# EAGLE schematic EasyBMS (EAGLE 9.6.2)
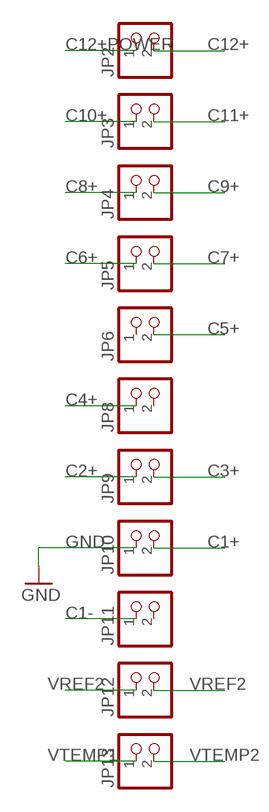
[diagram p0: schematic, sheet 1, part 1 of 3]
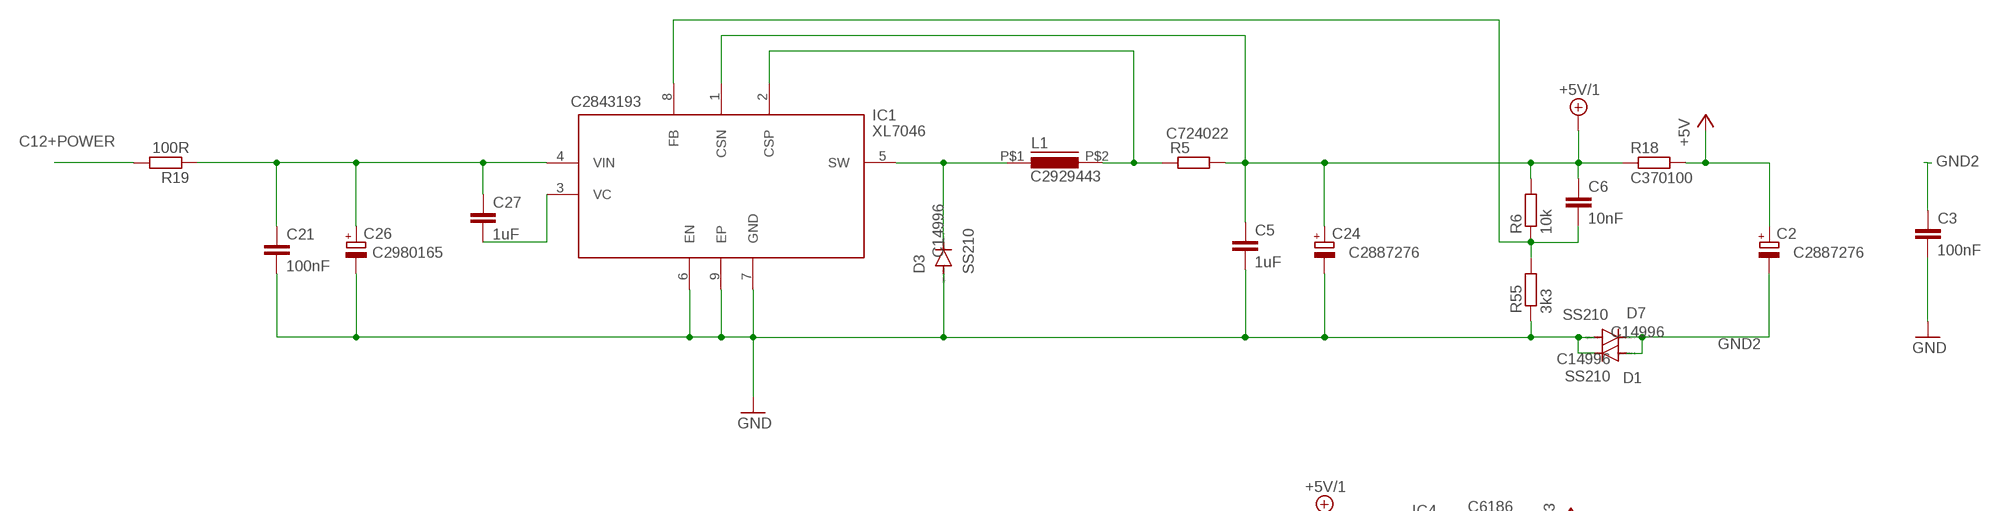
[diagram p1: schematic, sheet 1, part 2 of 3]
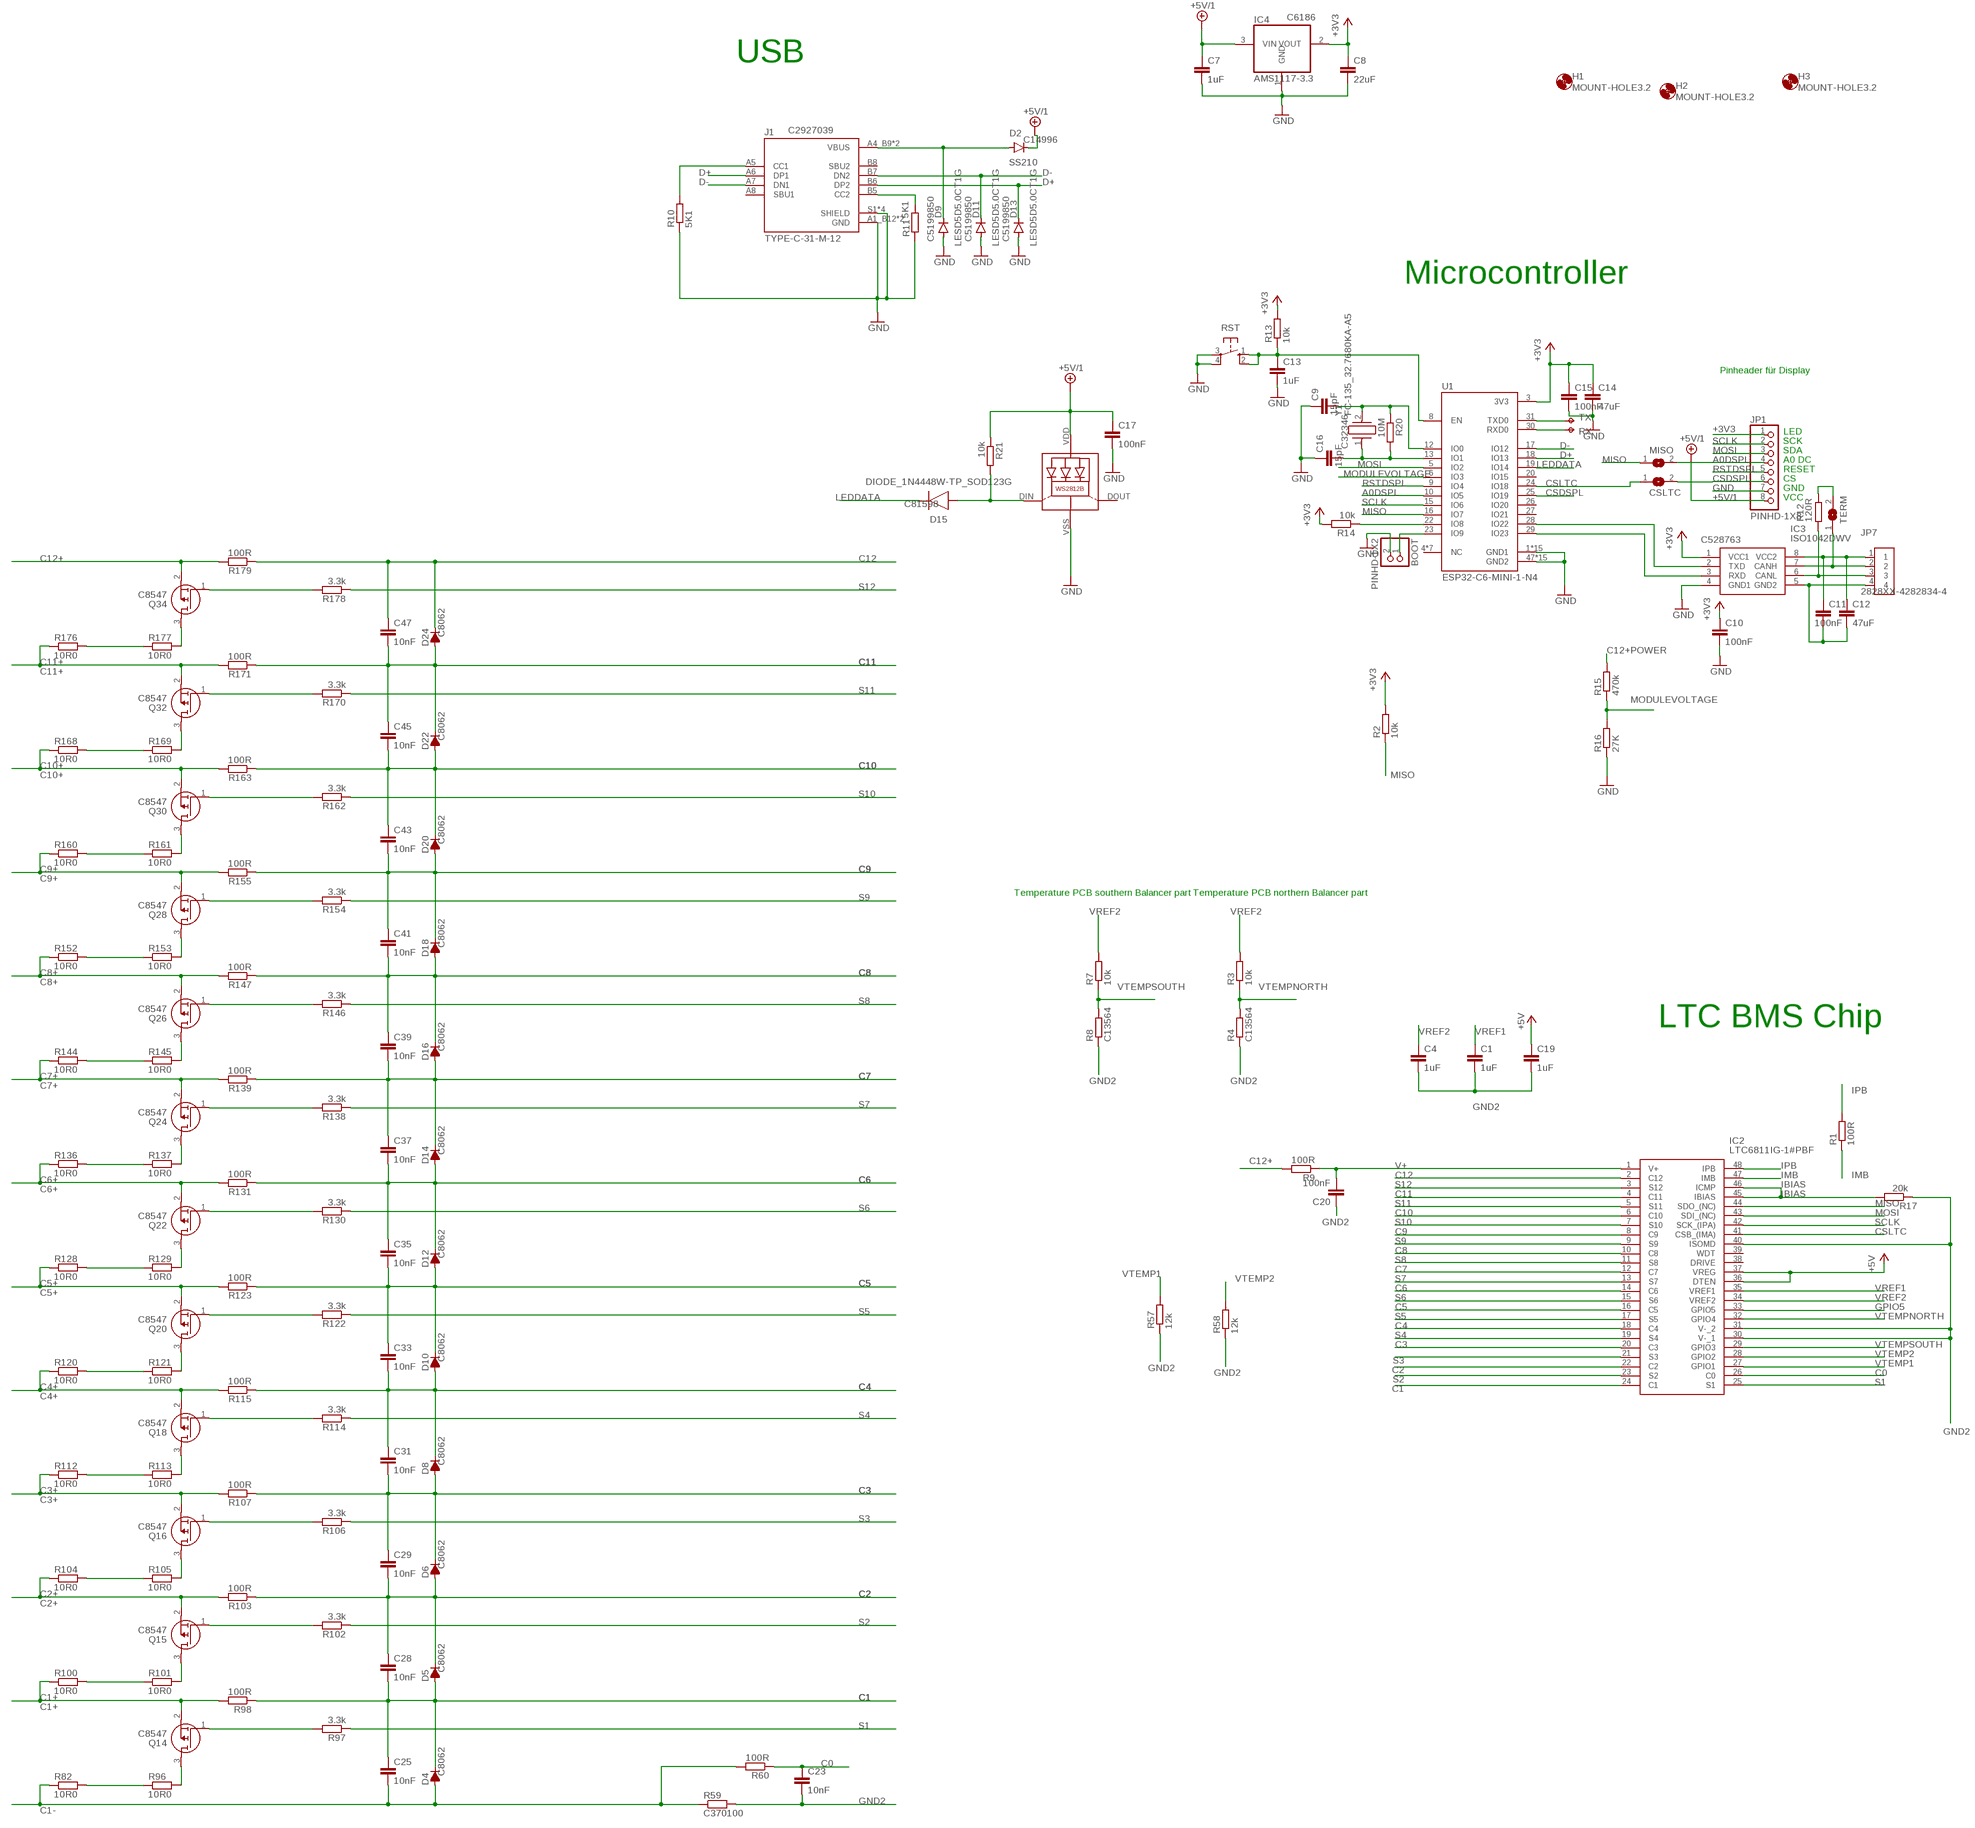
[diagram p2: schematic, sheet 1, part 3 of 3]

## Parts
BOOT  PINHD-1X2  [1X02]
C1  1uF  C-EUC0402  [C0402]
C2  CPOL-EU153CLV-0605  [153CLV-0605]
C3  100nF  C-EUC0402  [C0402]
C4  1uF  C-EUC0402  [C0402]
C5  1uF  C-EUC0402  [C0402]
C6  10nF  C-EUC0402  [C0402]
C7  1uF  C-EUC0402  [C0402]
C8  22uF  C-EUC0603  [C0603]
C9  15pF  C-EUC0402  [C0402]
C10  100nF  C-EUC0402  [C0402]
C11  100nF  C-EUC0402  [C0402]
C12  47uF  C-EUC1206  [C1206]
C13  1uF  C-EUC0402  [C0402]
C14  47uF  C-EUC0805  [C0805]
C15  100nF  C-EUC0402  [C0402]
C16  15pF  C-EUC0402  [C0402]
C17  100nF  C-EUC0402  [C0402]
C19  1uF  C-EUC0402  [C0402]
C20  100nF  C-EUC0805  [C0805]
C21  100nF  C-EUC0805  [C0805]
C23  10nF  C-EUC0402  [C0402]
C24  CPOL-EU153CLV-0605  [153CLV-0605]
C25  10nF  C-EUC0402  [C0402]
C26  CPOL-EU153CLV-0605  [153CLV-0605]
C27  1uF  C-EUC0603  [C0603]
C28  10nF  C-EUC0402  [C0402]
C29  10nF  C-EUC0402  [C0402]
C31  10nF  C-EUC0402  [C0402]
C33  10nF  C-EUC0402  [C0402]
C35  10nF  C-EUC0402  [C0402]
C37  10nF  C-EUC0402  [C0402]
C39  10nF  C-EUC0402  [C0402]
C41  10nF  C-EUC0402  [C0402]
C43  10nF  C-EUC0402  [C0402]
C45  10nF  C-EUC0402  [C0402]
C47  10nF  C-EUC0402  [C0402]
CSLTC  SJ  [SJ]
D1  SS210  DIODE-DO214AC  [DO214AC]
D2  SS210  DIODE-DO214AC  [DO214AC]
D3  SS210  DIODE-DO214AC  [DO214AC]
D4  D-FILL-MLL-34  [MELF-MLL34]
D5  D-FILL-MLL-34  [MELF-MLL34]
D6  D-FILL-MLL-34  [MELF-MLL34]
D7  SS210  DIODE-DO214AC  [DO214AC]
D8  D-FILL-MLL-34  [MELF-MLL34]
D9  LESD5D5.0CT1G  DIODE-SOD523  [SOD523]
D10  D-FILL-MLL-34  [MELF-MLL34]
D11  LESD5D5.0CT1G  DIODE-SOD523  [SOD523]
D12  D-FILL-MLL-34  [MELF-MLL34]
D13  LESD5D5.0CT1G  DIODE-SOD523  [SOD523]
D14  D-FILL-MLL-34  [MELF-MLL34]
D15  DIODE_1N4448W-TP_SOD123G  [SOD3715X135]
D16  D-FILL-MLL-34  [MELF-MLL34]
D18  D-FILL-MLL-34  [MELF-MLL34]
D20  D-FILL-MLL-34  [MELF-MLL34]
D22  D-FILL-MLL-34  [MELF-MLL34]
D24  D-FILL-MLL-34  [MELF-MLL34]
H1  MOUNT-HOLE3.2  [3,2]
H2  MOUNT-HOLE3.2  [3,2]
H3  MOUNT-HOLE3.2  [3,2]
IC1  XL7046  [SOIC127P600X170-9N]
IC2  LTC6811IG-1#PBF  [SOP50P780X200-48N]
IC3  ISO1042DWV  [SOIC127P1150X280-8N]
IC4  AMS1117-3.3  REG1117  [SOT223]
J1  TYPE-C-31-M-12  [HRO_TYPE-C-31-M-12]
JP1  PINHD-1X8  [1X08]
JP2  PINHD-1X2  [1X02]
JP3  PINHD-1X2  [1X02]
JP4  PINHD-1X2  [1X02]
JP5  PINHD-1X2  [1X02]
JP6  PINHD-1X2  [1X02]
JP7  2828XX-4282834-4  [TERMBLK_254-4N]
JP8  PINHD-1X2  [1X02]
JP9  PINHD-1X2  [1X02]
JP10  PINHD-1X2  [1X02]
JP11  PINHD-1X2  [1X02]
JP12  PINHD-1X2  [1X02]
JP13  PINHD-1X2  [1X02]
L1  C2929443  CY75-100UH  [CY75-100UH]
LED2  XL-1615RGBC-WS2812B  [XL-1615RGBC-WS2812B]
MISO  SJ  [SJ]
Q14  C8547  BSS308PEH6327XTSA1  [PG-SOT-23]
Q15  C8547  BSS308PEH6327XTSA1  [PG-SOT-23]
Q16  C8547  BSS308PEH6327XTSA1  [PG-SOT-23]
Q18  C8547  BSS308PEH6327XTSA1  [PG-SOT-23]
Q20  C8547  BSS308PEH6327XTSA1  [PG-SOT-23]
Q22  C8547  BSS308PEH6327XTSA1  [PG-SOT-23]
Q24  C8547  BSS308PEH6327XTSA1  [PG-SOT-23]
Q26  C8547  BSS308PEH6327XTSA1  [PG-SOT-23]
Q28  C8547  BSS308PEH6327XTSA1  [PG-SOT-23]
Q30  C8547  BSS308PEH6327XTSA1  [PG-SOT-23]
Q32  C8547  BSS308PEH6327XTSA1  [PG-SOT-23]
Q34  C8547  BSS308PEH6327XTSA1  [PG-SOT-23]
R1  100R  R-EU_R0603  [R0603]
R2  10k  R-EU_R0402  [R0402]
R3  10k  R-EU_R0603  [R0603]
R4  C13564  R-EU_R0603  [R0603]
R5  R-EU_R0402  [R0402]
R6  10k  R-EU_R0402  [R0402]
R7  10k  R-EU_R0603  [R0603]
R8  C13564  R-EU_R0603  [R0603]
R9  100R  R-EU_R0402  [R0402]
R10  5K1  R-EU_R0402  [R0402]
R11  5K1  R-EU_R0402  [R0402]
R12  120R  R-EU_R0402  [R0402]
R13  10k  R-EU_R0402  [R0402]
R14  10k  R-EU_R0402  [R0402]
R15  470k  R-EU_R0603  [R0603]
R16  27K  R-EU_R0603  [R0603]
R17  20k  R-EU_R0603  [R0603]
R18  C370100  R-EU_R1206  [R1206]
R19  100R  R-EU_R1206  [R1206]
R20  10M  R-EU_R0402  [R0402]
R21  10k  R-EU_R0402  [R0402]
R55  3k3  R-EU_R0402  [R0402]
R57  12k  R-EU_R0402  [R0402]
R58  12k  R-EU_R0402  [R0402]
R59  C370100  R-EU_R1206  [R1206]
R60  100R  R-EU_R0402  [R0402]
R82  10R0  R-EU_R1206  [R1206]
R96  10R0  R-EU_R1206  [R1206]
R97  3.3k  R-EU_R0402  [R0402]
R98  100R  R-EU_R0402  [R0402]
R100  10R0  R-EU_R1206  [R1206]
R101  10R0  R-EU_R1206  [R1206]
R102  3.3k  R-EU_R0402  [R0402]
R103  100R  R-EU_R0402  [R0402]
R104  10R0  R-EU_R1206  [R1206]
R105  10R0  R-EU_R1206  [R1206]
R106  3.3k  R-EU_R0402  [R0402]
R107  100R  R-EU_R0402  [R0402]
R112  10R0  R-EU_R1206  [R1206]
R113  10R0  R-EU_R1206  [R1206]
R114  3.3k  R-EU_R0402  [R0402]
R115  100R  R-EU_R0402  [R0402]
R120  10R0  R-EU_R1206  [R1206]
R121  10R0  R-EU_R1206  [R1206]
R122  3.3k  R-EU_R0402  [R0402]
R123  100R  R-EU_R0402  [R0402]
R128  10R0  R-EU_R1206  [R1206]
R129  10R0  R-EU_R1206  [R1206]
R130  3.3k  R-EU_R0402  [R0402]
R131  100R  R-EU_R0402  [R0402]
R136  10R0  R-EU_R1206  [R1206]
R137  10R0  R-EU_R1206  [R1206]
R138  3.3k  R-EU_R0402  [R0402]
R139  100R  R-EU_R0402  [R0402]
R144  10R0  R-EU_R1206  [R1206]
R145  10R0  R-EU_R1206  [R1206]
R146  3.3k  R-EU_R0402  [R0402]
R147  100R  R-EU_R0402  [R0402]
R152  10R0  R-EU_R1206  [R1206]
R153  10R0  R-EU_R1206  [R1206]
R154  3.3k  R-EU_R0402  [R0402]
R155  100R  R-EU_R0402  [R0402]
R160  10R0  R-EU_R1206  [R1206]
R161  10R0  R-EU_R1206  [R1206]
R162  3.3k  R-EU_R0402  [R0402]
R163  100R  R-EU_R0402  [R0402]
R168  10R0  R-EU_R1206  [R1206]
R169  10R0  R-EU_R1206  [R1206]
R170  3.3k  R-EU_R0402  [R0402]
R171  100R  R-EU_R0402  [R0402]
R176  10R0  R-EU_R1206  [R1206]
R177  10R0  R-EU_R1206  [R1206]
R178  3.3k  R-EU_R0402  [R0402]
R179  100R  R-EU_R0402  [R0402]
RST  10-XX  [B3F-10XX]
RX  TPB2,54  [B2,54]
TERM  SJ  [SJ]
TX  TPB2,54  [B2,54]
U1  ESP32-C6-MINI-1-N4  [XCVR_ESP32-C6-MINI-1-N4]
Y1  FC-135_32.7680KA-A5  [FC135327680KAA5]

## Nets
+3V3: C8.1 C10.1 C14.1 C15.1 IC3.1(VCC1) IC4.2(VOUT) JP1.1 R2.2 R13.2 R14.2 U1.3(3V3)
+5V: C2.+ C19.1 IC2.36(DTEN) IC2.37(VREG) R18.2
+5V/1: C5.1 C6.1 C7.1 C17.1 C24.+ D2.C IC1.1(CSN) IC4.3(VIN) JP1.8 LED2.VDD R5.2 R6.2 R18.1 R21.1
A0DSPL: JP1.4 MISO.2 U1.10(IO5)
C0: C23.1 IC2.26(C0) R60.1
C1: C25.1 C28.2 D4.1(C) D5.2(A) IC2.24(C1) R98.1
C1+: JP10.2 Q14.2(S) R98.2 R100.1
C1-: C25.2 D4.2(A) JP11.1 R59.1 R60.2 R82.1
C2: C28.1 C29.2 D5.1(C) D6.2(A) IC2.22(C2) R103.1
C2+: JP9.1 Q15.2(S) R103.2 R104.1
C3: C29.1 C31.2 D6.1(C) D8.2(A) IC2.20(C3) R107.1
C3+: JP9.2 Q16.2(S) R107.2 R112.1
C4: C31.1 C33.2 D8.1(C) D10.2(A) IC2.18(C4) R115.1
C4+: JP8.1 Q18.2(S) R115.2 R120.1
C5: C33.1 C35.2 D10.1(C) D12.2(A) IC2.16(C5) R123.1
C5+: JP6.2 Q20.2(S) R123.2 R128.1
C6: C35.1 C37.2 D12.1(C) D14.2(A) IC2.14(C6) R131.1
C6+: JP5.1 Q22.2(S) R131.2 R136.1
C7: C37.1 C39.2 D14.1(C) D16.2(A) IC2.12(C7) R139.1
C7+: JP5.2 Q24.2(S) R139.2 R144.1
C8: C39.1 C41.2 D16.1(C) D18.2(A) IC2.10(C8) R147.1
C8+: JP4.1 Q26.2(S) R147.2 R152.1
C9: C41.1 C43.2 D18.1(C) D20.2(A) IC2.8(C9) R155.1
C9+: JP4.2 Q28.2(S) R155.2 R160.1
C10: C43.1 C45.2 D20.1(C) D22.2(A) IC2.6(C10) R163.1
C10+: JP3.1 Q30.2(S) R163.2 R168.1
C11: C45.1 C47.2 D22.1(C) D24.2(A) IC2.4(C11) R171.1
C11+: JP3.2 Q32.2(S) R171.2 R176.1
C12: C47.1 D24.1(C) IC2.2(C12) R179.1
C12+: JP2.2 Q34.2(S) R9.2 R179.2
C12+POWER: JP2.1 R15.2 R19.2
CSDSPL: CSLTC.2 JP1.6 U1.25(IO19)
CSLTC: CSLTC.1 IC2.41(CSB_(IMA)) U1.24(IO18)
D+: D13.C J1.A6(DP1) J1.B6(DP2) U1.18(IO13)
D-: D11.C J1.A7(DN1) J1.B7(DN2) U1.17(IO12)
GND: BOOT.2 C3.2 C5.2 C7.2 C8.2 C9.1 C10.2 C13.2 C14.2 C15.2 C16.1 C17.2 C21.2 C24.- C26.- D1.C D3.A D7.A D9.A D11.A D13.A IC1.6(EN) IC1.7(GND) IC1.9(EP) IC3.4(GND1) IC4.1(GND) J1.A1_B12(GND) J1.B1_A12(GND) J1.S1(SHIELD) J1.S2(SHIELD) J1.S3(SHIELD) J1.S4(SHIELD) JP1.7 JP10.1 LED2.VSS(GND) R10.1 R11.1 R16.1 R55.1 RST.3(P) RST.4(P1) U1.1(GND1) U1.2(GND1) U1.11(GND1) U1.14(GND1) U1.36(GND1) U1.37(GND1) U1.38(GND1) U1.39(GND1) U1.40(GND1) U1.41(GND1) U1.42(GND1) U1.43(GND1) U1.44(GND1) U1.45(GND1) U1.46(GND1) U1.47(GND2) U1.48(GND2) U1.49_1(GND2) U1.49_2(GND2) U1.49_3(GND2) U1.49_4(GND2) U1.49_5(GND2) U1.49_6(GND2) U1.49_7(GND2) U1.49_8(GND2) U1.49_9(GND2) U1.50(GND2) U1.51(GND2) U1.52(GND2) U1.53(GND2)
GND2: C1.2 C2.- C3.1 C4.2 C19.2 C20.1 C23.2 D1.A D7.C IC2.30(V-_1) IC2.31(V-_2) IC2.40(ISOMD) R4.1 R8.1 R17.1 R57.1 R58.1 R59.2
GPIO5: IC2.33(GPIO5)
IBIAS: IC2.45(IBIAS) IC2.46(ICMP) R17.2
IMB: IC2.47(IMB) R1.1
IPB: IC2.48(IPB) R1.2
LEDDATA: D15.1(C) U1.19(IO14)
MISO: IC2.44(SDO_(NC)) MISO.1 R2.1 U1.16(IO7)
MODULEVOLTAGE: R15.1 R16.2 U1.6(IO3)
MOSI: IC2.43(SDI_(NC)) JP1.3 U1.5(IO2)
N$1: IC3.2(TXD) U1.28(IO22)
N$2: TX.TP U1.31(TXD0)
N$4: D2.A D9.C J1.A4_B9(VBUS) J1.B4_A9(VBUS)
N$6: C27.2 IC1.3(VC)
N$7: D3.C IC1.5(SW) L1.P$1
N$8: J1.A5(CC1) R10.2
N$9: J1.B5(CC2) R11.2
N$10: RX.TP U1.30(RXD0)
N$11: IC3.3(RXD) U1.29(IO23)
N$12: C11.1 C12.1 IC3.8(VCC2) JP7.1
N$13: IC3.7(CANH) JP7.2 TERM.1
N$14: IC3.6(CANL) JP7.3 R12.1
N$15: IC1.2(CSP) L1.P$2 R5.1
N$16: C11.2 C12.2 IC3.5(GND2) JP7.4
N$17: C13.1 R13.1 RST.1(S) RST.2(S1) U1.8(EN)
N$18: R82.2 R96.1
N$19: R12.2 TERM.2
N$20: R14.1 U1.22(IO8)
N$21: BOOT.1 U1.23(IO9)
N$22: C9.2 R20.1 U1.12(IO0) Y1.2
N$23: C16.2 R20.2 U1.13(IO1) Y1.1
N$24: D15.2(A) LED2.DIN(DI) R21.2
N$25: C6.2 IC1.8(FB) R6.1 R55.2
N$73: C21.1 C26.+ C27.1 IC1.4(VIN) R19.1
N$75: Q14.3(D) R96.2
N$76: Q14.1(G) R97.2
N$77: R100.2 R101.1
N$78: Q15.3(D) R101.2
N$79: Q15.1(G) R102.2
N$81: R104.2 R105.1
N$82: Q16.3(D) R105.2
N$83: Q16.1(G) R106.2
N$87: R112.2 R113.1
N$88: Q18.3(D) R113.2
N$89: Q18.1(G) R114.2
N$93: R120.2 R121.1
N$94: Q20.3(D) R121.2
N$95: Q20.1(G) R122.2
N$99: R128.2 R129.1
N$100: Q22.3(D) R129.2
N$101: Q22.1(G) R130.2
N$105: R136.2 R137.1
N$106: Q24.3(D) R137.2
N$107: Q24.1(G) R138.2
N$111: R144.2 R145.1
N$112: Q26.3(D) R145.2
N$113: Q26.1(G) R146.2
N$117: R152.2 R153.1
N$118: Q28.3(D) R153.2
N$119: Q28.1(G) R154.2
N$123: R160.2 R161.1
N$125: Q30.3(D) R161.2
N$126: Q30.1(G) R162.2
N$130: R168.2 R169.1
N$131: Q32.3(D) R169.2
N$132: Q32.1(G) R170.2
N$136: R176.2 R177.1
N$137: Q34.3(D) R177.2
N$138: Q34.1(G) R178.2
RSTDSPL: JP1.5 U1.9(IO4)
S1: IC2.25(S1) R97.1
S2: IC2.23(S2) R102.1
S3: IC2.21(S3) R106.1
S4: IC2.19(S4) R114.1
S5: IC2.17(S5) R122.1
S6: IC2.15(S6) R130.1
S7: IC2.13(S7) R138.1
S8: IC2.11(S8) R146.1
S9: IC2.9(S9) R154.1
S10: IC2.7(S10) R162.1
S11: IC2.5(S11) R170.1
S12: IC2.3(S12) R178.1
SCLK: IC2.42(SCK_(IPA)) JP1.2 U1.15(IO6)
V+: C20.2 IC2.1(V+) R9.1
VREF1: C1.1 IC2.35(VREF1)
VREF2: C4.1 IC2.34(VREF2) JP12.1 JP12.2 R3.2 R7.2
VTEMP1: IC2.27(GPIO1) JP13.1 R57.2
VTEMP2: IC2.28(GPIO2) JP13.2 R58.2
VTEMPNORTH: IC2.32(GPIO4) R3.1 R4.2
VTEMPSOUTH: IC2.29(GPIO3) R7.1 R8.2
Unconnected: IC2.38(DRIVE) IC2.39(WDT) J1.A8(SBU1) J1.B8(SBU2) JP6.1 JP8.2 JP11.2 LED2.DOUT(DO) U1.4(NC) U1.7(NC) U1.20(IO15) U1.21(NC) U1.26(IO20) U1.27(IO21) U1.32(NC) U1.33(NC) U1.34(NC) U1.35(NC)

## Notes on the sheet
- USB
- Microcontroller
- Pinheader für Display
- LED
- SCK
- SDA
- A0 DC
- RESET
- CS
- GND
- VCC
- Temperature PCB southern Balancer part | Temperature PCB northern Balancer part
- LTC BMS Chip

## Library data of the parts
BOOT = Connector:PINHD-1X2: PIN HEADER; CATEGORY: Headers; DESCRIPTION: Header-Straight-2 Position; PACKAGE_TYPE: THT; PITCH: 0.100" (2.54mm); SUBCATEGORY: Headers-Male Pins; TYPE: Board to Board or Cable-Unshrouded-Through Hole-Straight
C1 C3-C17 C19-C21 C23 C25 C27-C29 C31 C33 C35 C37 C39 C41 C43 C45 C47 = rcl:C-EU: CAPACITOR, European symbol; SPICEPREFIX: C
C2 C24 = rcl:CPOL-EU: POLARIZED CAPACITOR, European symbol; LCSC: C2887276; SPICEPREFIX: C
C26 = rcl:CPOL-EU: POLARIZED CAPACITOR, European symbol; LCSC: C2980165; SPICEPREFIX: C
CSLTC MISO TERM = jumper:SJ: SMD solder JUMPER
D1-D3 D7 = diode:DIODE-: DIODE; LCSC: C14996
D4-D6 D8 D10 D12 D14 D16 D18 D20 D22 D24 = semicon-smd-ipc_jonathan:D-FILL-: DIODE filled; LCSC: C8062
D9 D11 D13 = diode:DIODE-: DIODE; LCSC: C5199850
D15 = Diode:DIODE_: Diode Rectifier - Popular parts; CATEGORY: Diode; DATASHEET: https://www.mccsemi.com/pdf/products/1N4448W(SOD-123).pdf; DESCRIPTION: Diode 75 V 250mA Surface Mount SOD-123; FORWARD_CURRENT: 100mA; FORWARD_VOLTAGE: 1V; LCSC: C81598; MANUFACTURER: Micro Commercial Co; MPN: 1N4448W-TP; OPERATING_TEMPERATURE: -55°C ~ 150°C; PACKAGE_SIZE: SOD-123; PACKAGE_TYPE: SMD; PART_STATUS: ACTIVE; REVERSE_VOLTAGE: 75V; ROHS: COMPLIANT; SERIES: 1N4148; SUBCATEGORY: Rectifiers; TYPE: Small Signal Switching Diodes; ZENER_VOLTAGE: NA
H1-H3 = holes:MOUNT-HOLE: MOUNTING HOLE with drill center marker
IC1 = SamacSys_Parts:XL7046: XL7046 1.0A 100KHz 90V Buck DC to DC Converter General Description The XL7046 is a 100KHz fixed frequency PWM buck (step-down) DC/DC converter, capable of driving a 1.0A load with high efficiency, low ripple and excellent line and load regulation. Requiring a minimum number of external components, the regulator is simple to use and include internal frequency compensation and a fixed-frequency oscillator. Datasheet; DESCRIPTION: PWM Low-Side Driver 3A for Coils HSOP8 DRV103H, MOSFET Power Driver, 1.5A, Non-Inverting, 8 ??? 32 V, 8-Pin SO PowerPAD; HEIGHT: 1.7mm; LCSC: C2843193; MANUFACTURER_NAME: Texas Instruments; MANUFACTURER_PART_NUMBER: DRV103H; MOUSER_PART_NUMBER: 595-DRV103H; MOUSER_PRICE-STOCK: https://www.mouser.co.uk/ProductDetail/Texas-Instruments/DRV103H/?qs=VBduBm9rCJQEx63T3F6Ttg%3D%3D
IC2 = SamacSys_Parts:LTC6811IG-1#PBF: Battery Monitoring 5.7V Automotive 48-Pin SSOP Tube Source: Datasheet <https://www.arrow.com/en/products/ltc6811ig-1pbf/analog-devices>; DESCRIPTION: Battery Monitoring 5.7V Automotive 48-Pin SSOP Tube; HEIGHT: 2mm; MANUFACTURER_NAME: Analog Devices; MANUFACTURER_PART_NUMBER: LTC6811IG-1#PBF; MOUSER_PART_NUMBER: 584-LTC6811IG-1#PBF; MOUSER_PRICE-STOCK: https://www.mouser.co.uk/ProductDetail/Analog-Devices/LTC6811IG-1PBF?qs=oahfZPh6IAL9qJ0YPEk6qg%3D%3D
IC3 = ISO1042DWV:ISO1042DWV: CAN Interface IC Source: Datasheet <https://www.arrow.com/en/products/iso1042dwv/texas-instruments>; DESCRIPTION: CAN Interface IC; HEIGHT: 2.8mm; LCSC: C528763; MANUFACTURER_NAME: Texas Instruments; MANUFACTURER_PART_NUMBER: ISO1042DWV; MOUSER_PART_NUMBER: 595-ISO1042DWV; MOUSER_PRICE-STOCK: https://www.mouser.co.uk/ProductDetail/Texas-Instruments/ISO1042DWV?qs=qSfuJ%252Bfl%2Fd6fIgLDsh3Gaw%3D%3D
IC4 = burr-brown:REG1117: 800mA and 1A Low Dropout (LDO) Positive Regulator 1.8V, 2.5V, 2.85V, 3.3V, 5V, and Adj; LCSC: C6186; MPN: REG1117
J1 = TYPE-C-31-M-12:TYPE-C-31-M-12: Check availability <https://pricing.snapeda.com/parts/TYPE-C-31-M-12/HRO%20Electronics%20Co.%2C%20Ltd./view-part?ref=eda>; AVAILABILITY: Not in stock; CHECK_PRICES: https://www.snapeda.com/parts/TYPE-C-31-M-12/HRO+Electronics+Co.%252C+Ltd./view-part/?ref=eda; DESCRIPTION: USB Connectors 24 Receptacle 1 8.94*7.3mm RoHS; LCSC: C2927039; MF: HRO Electronics Co., Ltd.; MP: TYPE-C-31-M-12; PACKAGE: Package; PRICE: None; SNAPEDA_LINK: https://www.snapeda.com/parts/TYPE-C-31-M-12/HRO+Electronics+Co.%252C+Ltd./view-part/?ref=snap
JP1 = Connector:PINHD-1X8: PIN HEADER; CATEGORY: Headers; DESCRIPTION: Header-Straight-8 Position; PACKAGE_TYPE: THT; PITCH: 0.100" (2.54mm); SUBCATEGORY: Headers-Male Pins; TYPE: Board to Board or Cable-Unshrouded-Through Hole-Straight
JP2-JP6 JP8-JP13 = pinhead_own:PINHD-1X2: PIN HEADER; LCSC: C3337950
JP7 = Connector:2828XX-4: 4 Position Wire to Board Terminal Block Horizontal with Board Datasheet <https://www.te.com.cn/commerce/DocumentDelivery/DDEController?Action=showdoc&DocId=Catalog+Section%7F1308389_EUROSTYLE_TERMINAL_BLOCKS%7F0607%7Fpdf%7FEnglish%7FENG_CS_1308389_EUROSTYLE_TERMINAL_BLOCKS_0607.pdf%7F2-282837-5>; CATEGORY: Fixed Terminal Blocks; DATASHEET: https://www.te.com/usa-en/product-282834-4.datasheet.pdf; DESCRIPTION: 4 Position Wire to Board Terminal Block Horizontal with Board 0.100" (2.54mm) Through Hole; MANUFACTURER: TE Connectivity AMP Connectors; MPN: 282834-4; OPERATING_TEMPERATURE: -40°C ~ 105°C; PACKAGE_SIZE: NA; PACKAGE_TYPE: THT; PART_STATUS: ACTIVE; PITCH: 0.100" (2.54mm); ROHS: COMPLIANT; SERIES: Buchanan; SUBCATEGORY: Terminal Blocks; TYPE: Through Hole Screw - Rising Cage Clamp Side wire entry Horizontal with Board
L1 = SamacSys_Parts:CY75-100UH; LCSC: C2929443
LED2 = WS2812B:XL-1615RGBC-WS2812B: C5349954 Absolute Maximum Ratings Power supply voltage: VDD +3.5V..+5.3V Input voltage: VI -0.5V..VDD+0.5V; LCSC: C5349954
Q14-Q16 Q18 Q20 Q22 Q24 Q26 Q28 Q30 Q32 Q34 = SamacSys_Parts:BSS308PEH6327XTSA1: Infineon BSS308PEH6327XTSA1 P-channel MOSFET, 1.6 A, 30 V OptiMOS P, 3-Pin SOT-23 Source: Datasheet <https://www.infineon.com/dgdl/Infineon-BSS308PE-DS-v02_03-en.pdf?fileId=db3a304330f686060131099c80400073>; DESCRIPTION: Infineon BSS308PEH6327XTSA1 P-channel MOSFET, 1.6 A, 30 V OptiMOS P, 3-Pin SOT-23; HEIGHT: mm; MANUFACTURER_NAME: Infineon; MANUFACTURER_PART_NUMBER: BSS308PEH6327XTSA1; MOUSER_PART_NUMBER: 726-BSS308PEH6327XTS; MOUSER_PRICE-STOCK: https://www.mouser.co.uk/ProductDetail/Infineon-Technologies/BSS308PEH6327XTSA1?qs=K00xGehIljswKa%252BUULwt9w%3D%3D
R1-R4 R6-R21 R55 R57-R60 R82 R96-R98 R100-R107 R112-R115 R120-R123 R128-R131 R136-R139 R144-R147 R152-R155 R160-R163 R168-R171 R176-R179 = rcl:R-EU_: RESISTOR, European symbol; SPICEPREFIX: R
R5 = rcl:R-EU_: RESISTOR, European symbol; LCSC: C724022; SPICEPREFIX: R
RST = switch-omron:10-XX: OMRON SWITCH; MPN: B3F-1000; OC_FARNELL: 176432; OC_NEWARK: 36M3542
RX TX = testpad:TP: Test pad
U1 = ESP32-C6-MINI-1-N4:ESP32-C6-MINI-1-N4; LCSC: C5736265; MANUFACTURER: Espressif Systems; MAXIMUM_PACKAGE_HEIGHT: 2.55 mm; PARTREV: 1.0; STANDARD: Manufacturer recommendations
Y1 = FC-135_32.7680KA-A5:FC-135_32.7680KA-A5: Crystal 0.032768MHz +/-20ppm (Tol) 12.5pF FUND 70000Ohm 2-Pin CSMD T/R Source: Datasheet <https://support.epson.biz/td/api/doc_check.php?dl=brief_FC-135&lang=en>; DESCRIPTION: Crystal 0.032768MHz +/-20ppm (Tol) 12.5pF FUND 70000Ohm 2-Pin CSMD T/R; HEIGHT: 0.9mm; LCSC: C32346; MANUFACTURER_NAME: Epson Timing; MANUFACTURER_PART_NUMBER: FC-135 32.7680KA-A5; MOUSER_PART_NUMBER: 732-532.7680KA-A5; MOUSER_PRICE-STOCK: https://www.mouser.co.uk/ProductDetail/Epson-Timing/FC-135-32.7680KA-A5?qs=f9yNj16SXrJ7J65t%252BHv0JQ%3D%3D